# Altium schematic sheet I2C_Sensor.SchDoc
size 420 x 297 mm; SheetNumber: 8; SheetTotal: 11
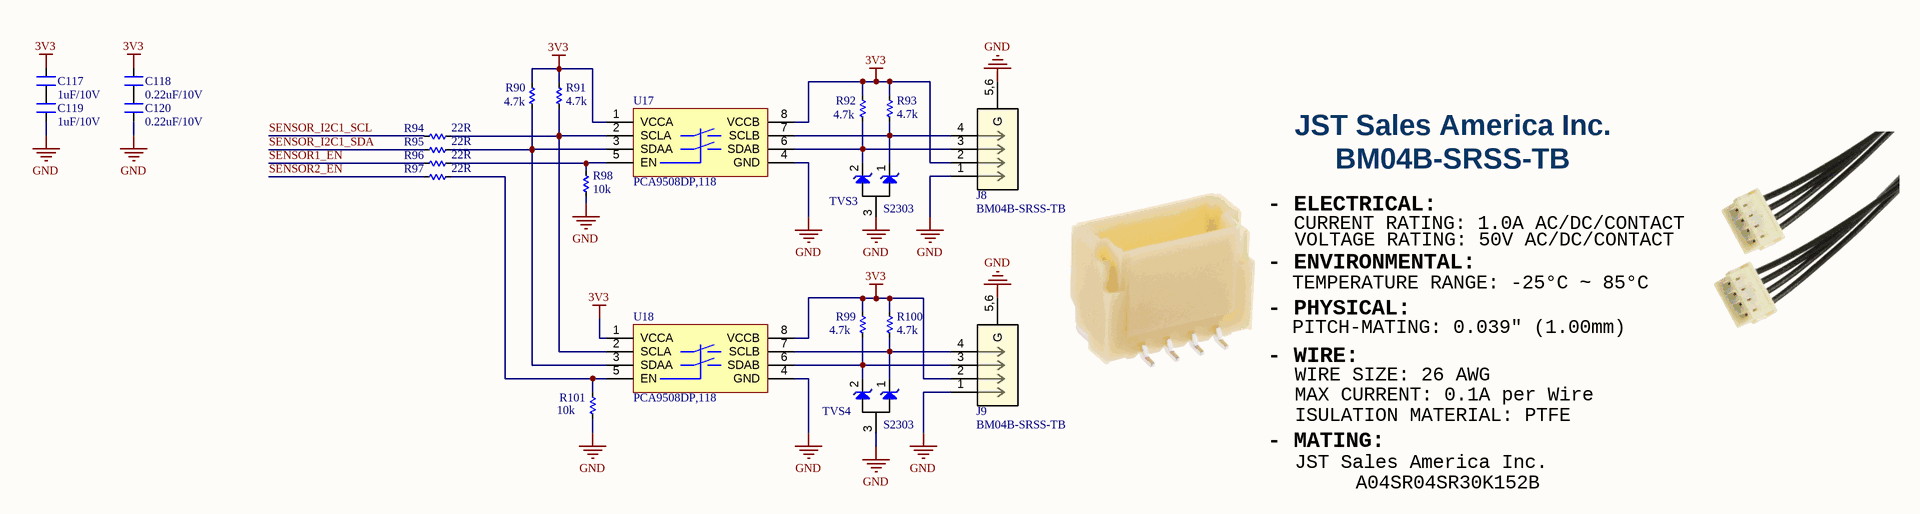
[diagram p0: I2C_Sensor.SchDoc]

## Parts
C117  1uF/10V  [CAP_C_1608X80]
C118  0.22uF/10V  [CAP_C_1608X80]
C119  1uF/10V  [CAP_C_1608X80]
C120  0.22uF/10V  [CAP_C_1608X80]
J8  BM04B-SRSS-TB  [BM04B-SRSS-TB]
J9  BM04B-SRSS-TB  [BM04B-SRSS-TB]
R90  4.7k  [RES_C_1608X60]
R91  4.7k  [RES_C_1608X60]
R92  4.7k  [RES_C_1608X60]
R93  4.7k  [RES_C_1608X60]
R94  22R  [RES_C_1608X60]
R95  22R  [RES_C_1608X60]
R96  22R  [RES_C_1608X60]
R97  22R  [RES_C_1608X60]
R98  10k  [RES_C_1608X60]
R99  4.7k  [RES_C_1608X60]
R100  4.7k  [RES_C_1608X60]
R101  10k  [RES_C_1608X60]
TVS3  S2303  [sot23-12_3]
TVS4  S2303  [sot23-12_3]
U17  PCA9508DP,118  [TSOP8]
U18  PCA9508DP,118  [TSOP8]

## Nets
3V3: C117.2 C118.2 J8.2 J9.2 R90.1 R91.1 R92.1 R93.1 R99.1 R100.1 U17.1(VCCA) U17.8(VCCB) U18.1(VCCA) U18.8(VCCB)
GND: C119.1 C120.1 J8.1 J8.5,6(G) J9.1 J9.5,6(G) R98.2 R101.2 TVS3.3 TVS4.3 U17.4(GND) U18.4(GND)
SENSOR1_EN: R96.1
SENSOR2_EN: R97.1
SENSOR_I2C1_SCL: R94.1
SENSOR_I2C1_SDA: R95.1
NetC117_1: C117.1 C119.2
NetC118_1: C118.1 C120.2
NetJ8_3: J8.3 R92.2 TVS3.2 U17.6(SDAB)
NetJ8_4: J8.4 R93.2 TVS3.1 U17.7(SCLB)
NetJ9_3: J9.3 R99.2 TVS4.2 U18.6(SDAB)
NetJ9_4: J9.4 R100.2 TVS4.1 U18.7(SCLB)
NetR90_2: R90.2 R95.2 U17.3(SDAA) U18.3(SDAA)
NetR91_2: R91.2 R94.2 U17.2(SCLA) U18.2(SCLA)
NetR96_2: R96.2 R98.1 U17.5(EN)
NetR97_2: R97.2 R101.1 U18.5(EN)

## Notes on the sheet
- JST Sales America Inc.
- - ELECTRICAL:
- BM04B-SRSS-TB
- - ENVIRONMENTAL:
- CURRENT RATING: 1.0A AC/DC/CONTACT
- VOLTAGE RATING: 50V AC/DC/CONTACT
- - PHYSICAL:
- TEMPERATURE RANGE: -25°C ~ 85°C
- PITCH-MATING: 0.039" (1.00mm)
- - WIRE:
- WIRE SIZE: 26 AWG
- MAX CURRENT: 0.1A per Wire
- - MATING:
- ISULATION MATERIAL: PTFE
- A04SR04SR30K152B
- Project:
- BEE-PC1
- Sub-system:
- NANORACK_EXP_CONTROLLER
- Design by:
- SANG HUYNH
- BAO BUI Q.
- Sheet title:
- Sheet
- A3
- of
- Checked by:
- Approved by:
- VU PHAM
- Revision:
- Document No:
- V1.1.0
- Size:
- Date:

## Library data of the parts
C117-C120 = Capacitors: Value: 33pF
J8 J9 = BM04B-SRSS-TB: CONN HEADER SMD 4POS 1MM
R90-R101 = Res SMD: SMD; Manufacturer: Generic Components; Class: Passive; Published: 08/06/2000; Publisher: Altium Hobart Technology Centre
TVS3 TVS4 = S2305: TVS DIODE 3.3VWM 8VC SOT233